# EAGLE design key-board (EAGLE 6.4)
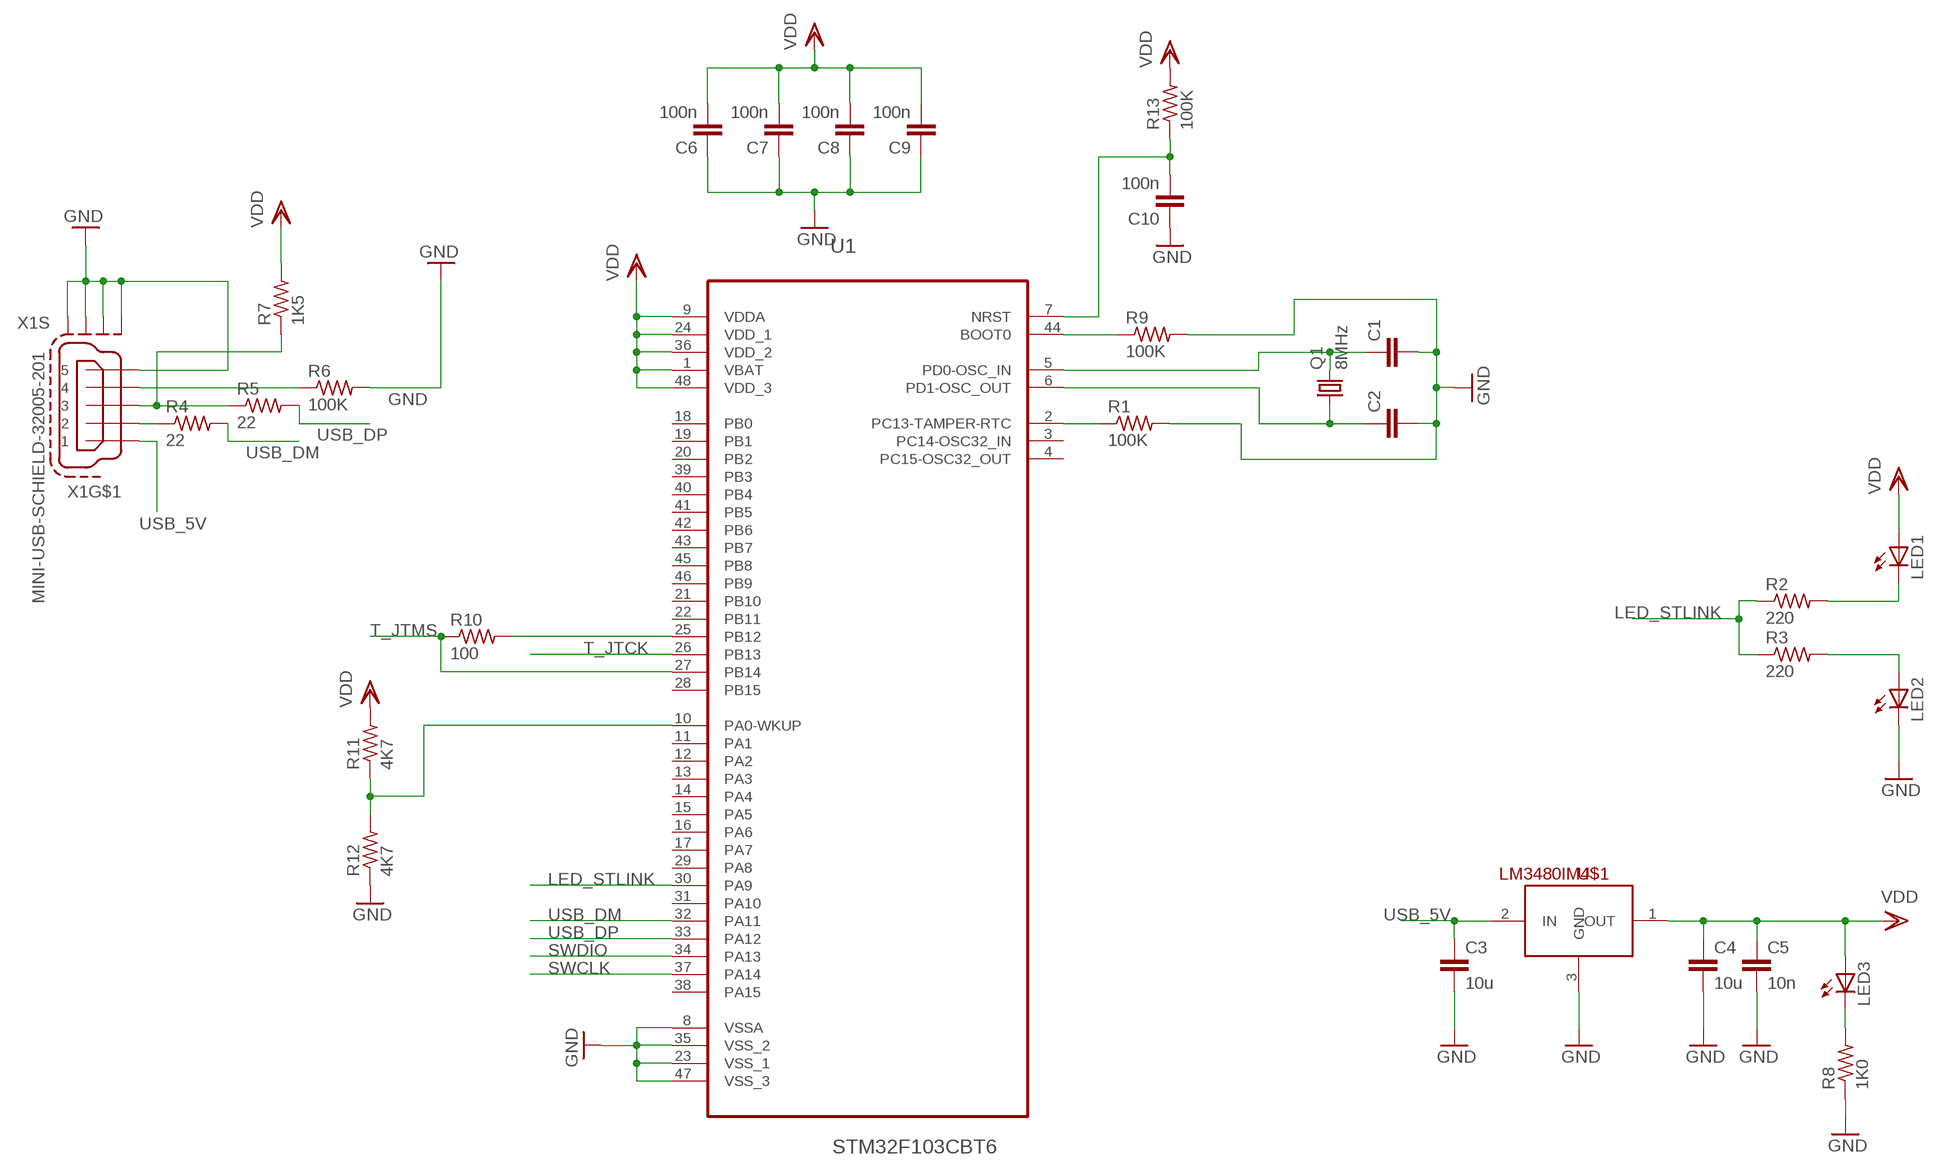
[diagram p0: schematic, sheet 1]

## Parts
C1  C-EUC0402  [C0402]
C2  C-EUC0402  [C0402]
C3  10u  C-EUC0805  [C0805]
C4  10u  C-EUC0805  [C0805]
C5  10n  C-EUC0402  [C0402]
C6  100n  C-EUC0402  [C0402]
C7  100n  C-EUC0402  [C0402]
C8  100n  C-EUC0402  [C0402]
C9  100n  C-EUC0402  [C0402]
C10  100n  C-EUC0402  [C0402]
LED1  LEDCHIPLED-0603-TTW  [CHIPLED-0603-TTW]
LED2  LEDCHIPLED-0603-TTW  [CHIPLED-0603-TTW]
LED3  LEDCHIPLED-0603-TTW  [CHIPLED-0603-TTW]
Q1  8MHz  CRYSTALHC49U-V  [HC49U-V]
R1  100K  R-US_R0402  [R0402]
R2  220  R-US_R0402  [R0402]
R3  220  R-US_R0402  [R0402]
R4  22  R-US_R0402  [R0402]
R5  22  R-US_R0402  [R0402]
R6  100K  R-US_R0402  [R0402]
R7  1K5  R-US_R0402  [R0402]
R8  1K0  R-US_R0402  [R0402]
R9  100K  R-US_R0402  [R0402]
R10  100  R-US_R0402  [R0402]
R11  4K7  R-US_R0402  [R0402]
R12  4K7  R-US_R0402  [R0402]
R13  100K  R-US_R0402  [R0402]
U1  STM32F103CBT6  [QFP50P900X900X160-48N]
U$1  LM3480IM4  [SOT23-3]
X1  MINI-USB-SCHIELD-32005-201  [32005-201]

## Nets
GND: C1.2 C2.2 C3.2 C4.2 C5.2 C6.1 C7.1 C8.1 C9.1 C10.1 LED2.C@1(C) R1.2 R6.2 R8.1 R9.2 R12.1 U1.8(VSSA) U1.23(VSS_1) U1.35(VSS_2) U1.47(VSS_3) U$1.3(GND) X1.5 X1.M1(S:S1) X1.M2(S:S2) X1.M3(S:S3) X1.M4(S:S4)
LED_STLINK: R2.1 R3.1 U1.30(PA9)
N$1: C1.1 Q1.2 U1.5(PD0-OSC_IN)
N$2: C2.1 Q1.1 U1.6(PD1-OSC_OUT)
N$3: R6.1 X1.4
N$4: R1.1 U1.2(PC13-TAMPER-RTC)
N$5: LED1.C@1(C) R2.2
N$6: LED2.A@1(A) R3.2
N$7: R5.1 R7.1 X1.3
N$8: R4.1 X1.2
N$9: LED3.C@1(C) R8.2
N$10: R11.1 R12.2 U1.10(PA0-WKUP)
N$11: C10.2 R13.1 U1.7(NRST)
N$14: R9.1 U1.44(BOOT0)
N$17: R10.2 U1.25(PB12)
SWCLK: U1.37(PA14)
SWDIO: U1.34(PA13)
T_JTCK: U1.26(PB13)
T_JTMS: R10.1 U1.27(PB14)
USB_5V: C3.1 U$1.2(IN) X1.1
USB_DM: R4.2 U1.32(PA11)
USB_DP: R5.2 U1.33(PA12)
VDD: C4.1 C5.1 C6.2 C7.2 C8.2 C9.2 LED1.A@1(A) LED3.A@1(A) R7.2 R11.2 R13.2 U1.1(VBAT) U1.9(VDDA) U1.24(VDD_1) U1.36(VDD_2) U1.48(VDD_3) U$1.1(OUT)
Unconnected: U1.3(PC14-OSC32_IN) U1.4(PC15-OSC32_OUT) U1.11(PA1) U1.12(PA2) U1.13(PA3) U1.14(PA4) U1.15(PA5) U1.16(PA6) U1.17(PA7) U1.18(PB0) U1.19(PB1) U1.20(PB2) U1.21(PB10) U1.22(PB11) U1.28(PB15) U1.29(PA8) U1.31(PA10) U1.38(PA15) U1.39(PB3) U1.40(PB4) U1.41(PB5) U1.42(PB6) U1.43(PB7) U1.45(PB8) U1.46(PB9)

## Library data of the parts
C1-C10 = rcl:C-EU: CAPACITOR, European symbol
LED1-LED3 = adafruit:LED: LED OSRAM: - CHIPLED LG R971, LG N971, LY N971, LG Q971, LY Q971, LO R971, LY R971 LH N974, LH R974 LS Q976, LO Q976, LY Q976 LO Q996 - Hyper CHIPLED LW Q18S LB Q993, LB Q99A, LB R99A - SideLED LS A670, LO A670, LY A670, LG A670, LP A670 LB A673, LV A673, LT A673, LW A673 LH A674 LY A675 LS A676, LA A676, LO A676, LY A676, LW A676 LS A679, LY A679, LG A679 - Hyper Micro SIDELED® LS Y876, LA Y876, LO Y876, LY Y876 LT Y87S - SmartLED LW L88C, LW L88S LB L89C, LB L89S, LG L890 LS L89K, LO L89K, LY L89K LS L896, LA L896, LO L896, LY L896 - TOPLED LS T670, LO T670, LY T670, LG T670, LP T670 LSG T670, LSP T670, LSY T670, LOP T670, LYG T670 LG T671, LOG T671, LSG T671 LB T673, LV T673, LT T673, LW T673 LH T674 LS T676, LA T676, LO T676, LY T676, LB T676, LH T676, LSB T676, LW T676 LB T67C, LV T67C, LT T67C, LS T67K, LO T67K, LY T67K, LW E67C LS E67B, LA E67B, LO E67B, LY E67B, LB E67C, LV E67C, LT E67C LW T67C LS T679, LY T679, LG T679 LS T770, LO T770, LY T770, LG T770, LP T770 LB T773, LV T773, LT T773, LW T773 LH T774 LS E675, LA E675, LY E675, LS T675 LS T776, LA T776, LO T776, LY T776, LB T776 LHGB T686 LT T68C, LB T68C - Hyper Mini TOPLED® LB M676 - Mini TOPLED Santana® LG M470 LS M47K, LO M47K, LY M47K Source: http://www.osram.convergy.de/
Q1 = adafruit:CRYSTAL: CRYSTAL; OC_FARNELL: 1666969; OC_NEWARK: unknown
R1-R13 = rcl:R-US_: RESISTOR, American symbol
U1 = ST Microelctronics_By_element14_Batch_1:STM32F103CBT6: Medium-density performance line ARM-based 32-bit MCU; MPN: STM32F103CBT6; OC_FARNELL: 1606327; OC_NEWARK: 11N8296; PACKAGE: QFP-48; SUPPLIER: STMICROELECTRONICS
U$1 = SparkFun:LM3480IM4
X1 = con-cypressindustries:MINI-USB-SCHIELD-: MINI USB-B Conector Source: www.cypressindustries.com; OC_FARNELL: unknown; OC_NEWARK: unknown

## Board
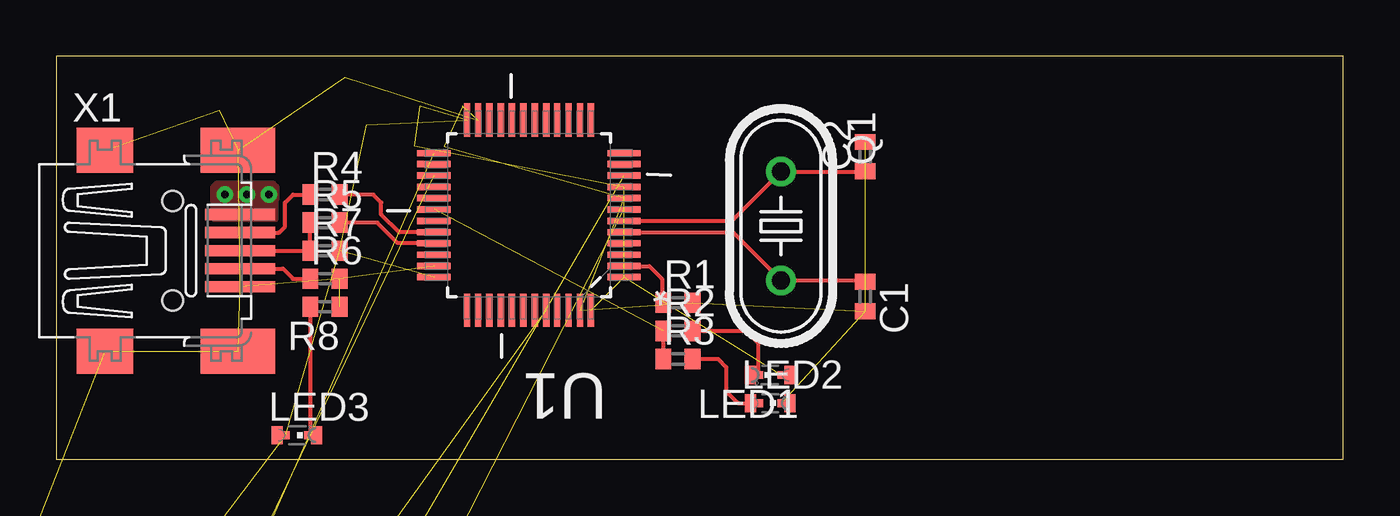
[diagram p1: board, top side]
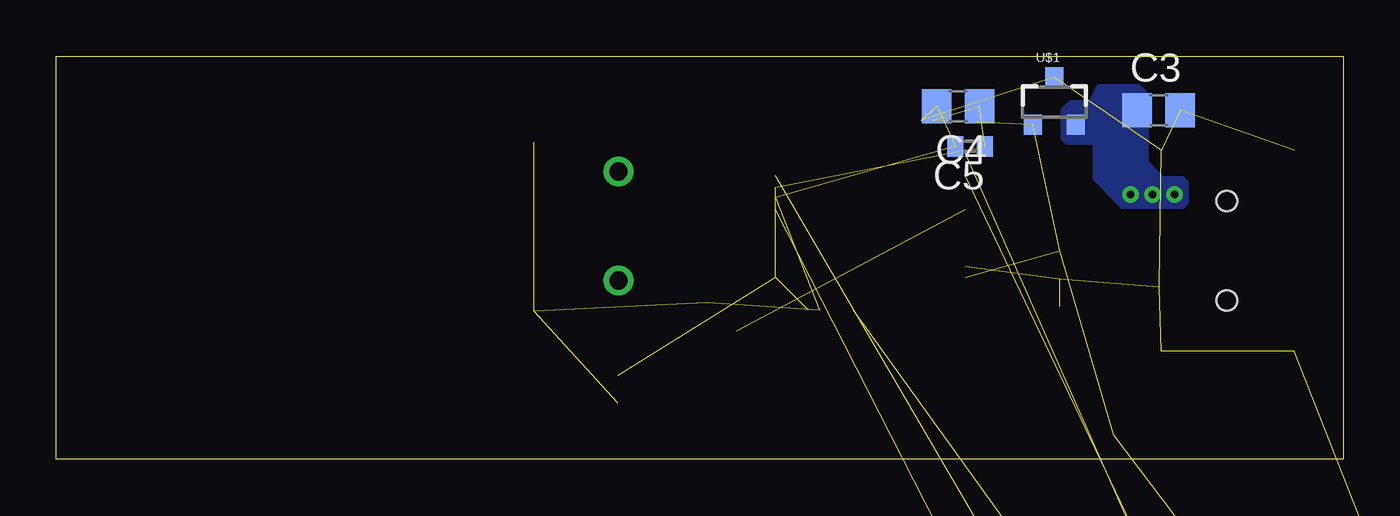
[diagram p2: board, bottom side, seen from below]

Size 57.05 x 17.86 mm. Coordinates in mm from the lower left corner, seen from the top.
Outline: 0,0 57.05,0 57.05,17.86 0,17.86 0,0
Copper layers (1*16): Top 0.035mm / dielectric 1.5mm / Bottom 0.035mm
Design rules "default": minimum track width 10mil, minimum drill 24mil, track to track 8mil, track to pad 8mil, pad to pad 8mil, via to via 8mil, smd to smd 8mil, copper to edge 40mil, drill to drill 8mil, minimum pad ring 10mil, minimum via ring 8mil, stop-mask expansion 4mil, vias tented up to drill 0mil, thermal gap 10mil

### Footprints (pad centres in the part's own frame; a part is rotated, then mirrored left to right if it is on the bottom)
C0402 = smd 0.7 x 0.9: 1 -0.65,0; 2 0.65,0
C0805 = smd 1.3 x 1.5: 1 -0.95,0; 2 0.95,0
CHIPLED-0603-TTW = smd 0.8 x 0.5: A 0,-0.875; C 0,0.875 | smd 0.35 x 0.35: A@1 0,-0.5; C@1 0,0.5
HC49U-V = drill 0.813: 1 -2.413,0; 2 2.413,0
R0402 = smd 0.7 x 0.9: 1 -0.65,0; 2 0.65,0
QFP50P900X900X160-48N = smd 1.473 x 0.279: 1 -4.216,2.743; 2 -4.216,2.261; 3 -4.216,1.753; 4 -4.216,1.245; 5 -4.216,0.762; 6 -4.216,0.254; 7 -4.216,-0.254; 8 -4.216,-0.762; 9 -4.216,-1.245; 10 -4.216,-1.753; 11 -4.216,-2.261; 12 -4.216,-2.743; 25 4.216,-2.743; 26 4.216,-2.261; 27 4.216,-1.753; 28 4.216,-1.245; 29 4.216,-0.762; 30 4.216,-0.254; 31 4.216,0.254; 32 4.216,0.762; 33 4.216,1.245; 34 4.216,1.753; 35 4.216,2.261; 36 4.216,2.743 | smd 0.279 x 1.473: 13 -2.743,-4.216; 14 -2.261,-4.216; 15 -1.753,-4.216; 16 -1.245,-4.216; 17 -0.762,-4.216; 18 -0.254,-4.216; 19 0.254,-4.216; 20 0.762,-4.216; 21 1.245,-4.216; 22 1.753,-4.216; 23 2.261,-4.216; 24 2.743,-4.216; 37 2.743,4.216; 38 2.261,4.216; 39 1.753,4.216; 40 1.245,4.216; 41 0.762,4.216; 42 0.254,4.216; 43 -0.254,4.216; 44 -0.762,4.216; 45 -1.245,4.216; 46 -1.753,4.216; 47 -2.261,4.216; 48 -2.743,4.216
SOT23-3 = smd 0.8 x 0.9: 1 -0.95,-1; 2 0.95,-1; 3 0,1.1
32005-201 = smd 3.1 x 0.5: 1 3,1.6; 2 3,0.8; 3 3,0; 4 3,-0.8; 5 3,-1.6 | smd 2.5 x 2: M1 -3,-4.45; M2 -3,4.45 | smd 3.3 x 2: M3 2.9,4.45; M4 2.9,-4.45 | hole 0.9: 0,2.2; 0,-2.2

### Placement (x,y rotation side)
C1  35.86,7.21 270 top
C2  35.86,13.41 90 top
C3  8.18,15.47 0 bottom
C4  17.07,15.65 180 bottom
C5  16.54,13.87 180 bottom
C6  -7.47,-21.34 0 top  (outside the outline)
C7  -7.47,-24.71 0 top  (outside the outline)
C8  -7.47,-28.09 0 top  (outside the outline)
C9  -7.47,-31.47 0 top  (outside the outline)
C10  -7.47,-58.85 0 top  (outside the outline)
LED1  31.65,3.73 90 top
LED2  31.65,2.49 270 top
LED3  10.67,1.07 270 top
Q1  32.13,10.34 270 top
R1  27.56,6.93 0 top
R2  27.56,5.69 0 top
R3  27.56,4.45 0 top
R4  11.91,11.73 0 top
R5  11.91,10.49 0 top
R6  11.91,8 0 top
R7  11.91,9.25 0 top
R8  11.91,6.76 180 top
R9  -7.47,-34.85 0 top  (outside the outline)
R10  -7.47,-39.65 0 top  (outside the outline)
R11  -7.47,-44.45 0 top  (outside the outline)
R12  -7.47,-49.25 0 top  (outside the outline)
R13  -7.47,-54.05 0 top  (outside the outline)
U1  20.95,10.82 180 top
U$1  12.8,15.82 0 bottom
X1  5.16,9.25 0 top

### Tracks (layer width: path | path; a pad name or v marks a point on that pad's centre or on a via)
GND  (25 unrouted)
LED_STLINK  (1 unrouted)
  Top 0.178: R2.1 R3.1
N$1
  Top 0.178: U1.5 30,10.06 Q1.2 35.8,7.92 C1.1
N$2
  Top 0.178: U1.6 29.95,10.57 Q1.1 C2.1
N$3
  Top 0.178: X1.4 10.05,8.45 10.49,8 R6.1
N$4
  Top 0.178: U1.2 26.29,8.56 26.85,8 26.85,7 R1.1
N$5
  Top 0.178: R2.2 30.58,5.69 31.11,5.16 31.11,3.77 LED1.C@1
N$6
  Top 0.178: R3.2 29.34,4.44 29.69,4.09 29.69,3.02 30.23,2.49 LED2.A@1
N$7
  Top 0.178: X1.3 R7.1 R5.1
N$8
  Top 0.178: X1.2 9.87,10.05 10.14,10.31 10.14,11.38 10.49,11.73 R4.1
N$9
  Top 0.178: R8.2 11.26,1.16 LED3.C@1
N$10  (2 unrouted)
N$11  (2 unrouted)
N$14  (1 unrouted)
N$17  (1 unrouted)
T_JTMS  (1 unrouted)
USB_5V  (via drill 0.33)
  other vias: 9.42,11.73 8.45,11.73 7.47,11.73
  pour Bottom (rank 5, no thermals): 9.78,11.2 7.11,11.2 6.93,11.38 6.93,12.27 7.11,12.45 8,12.45 8.71,13.16 8.71,16.18 9.07,16.54 10.85,16.54 11.2,15.82 12.09,15.82 12.45,15.47 12.45,14.22 12.27,14.05 11.02,14.05 11.02,12.45
  pour Top (rank 5, no thermals): 9.6,10.49 7.11,10.49 6.93,10.67 6.93,12.09 7.11,12.27 9.6,12.27 9.78,12.09 9.78,10.67
USB_DM
  Top 0.178: U1.32 15.19,10.06 14.4,10.85 14.4,11.38 14.05,11.73 R4.2
USB_DP
  Top 0.178: U1.33 15.14,9.58 14.22,10.49 R5.2
VDD  (16 unrouted)